# EAGLE design 224_distance (EAGLE 9.5.1)
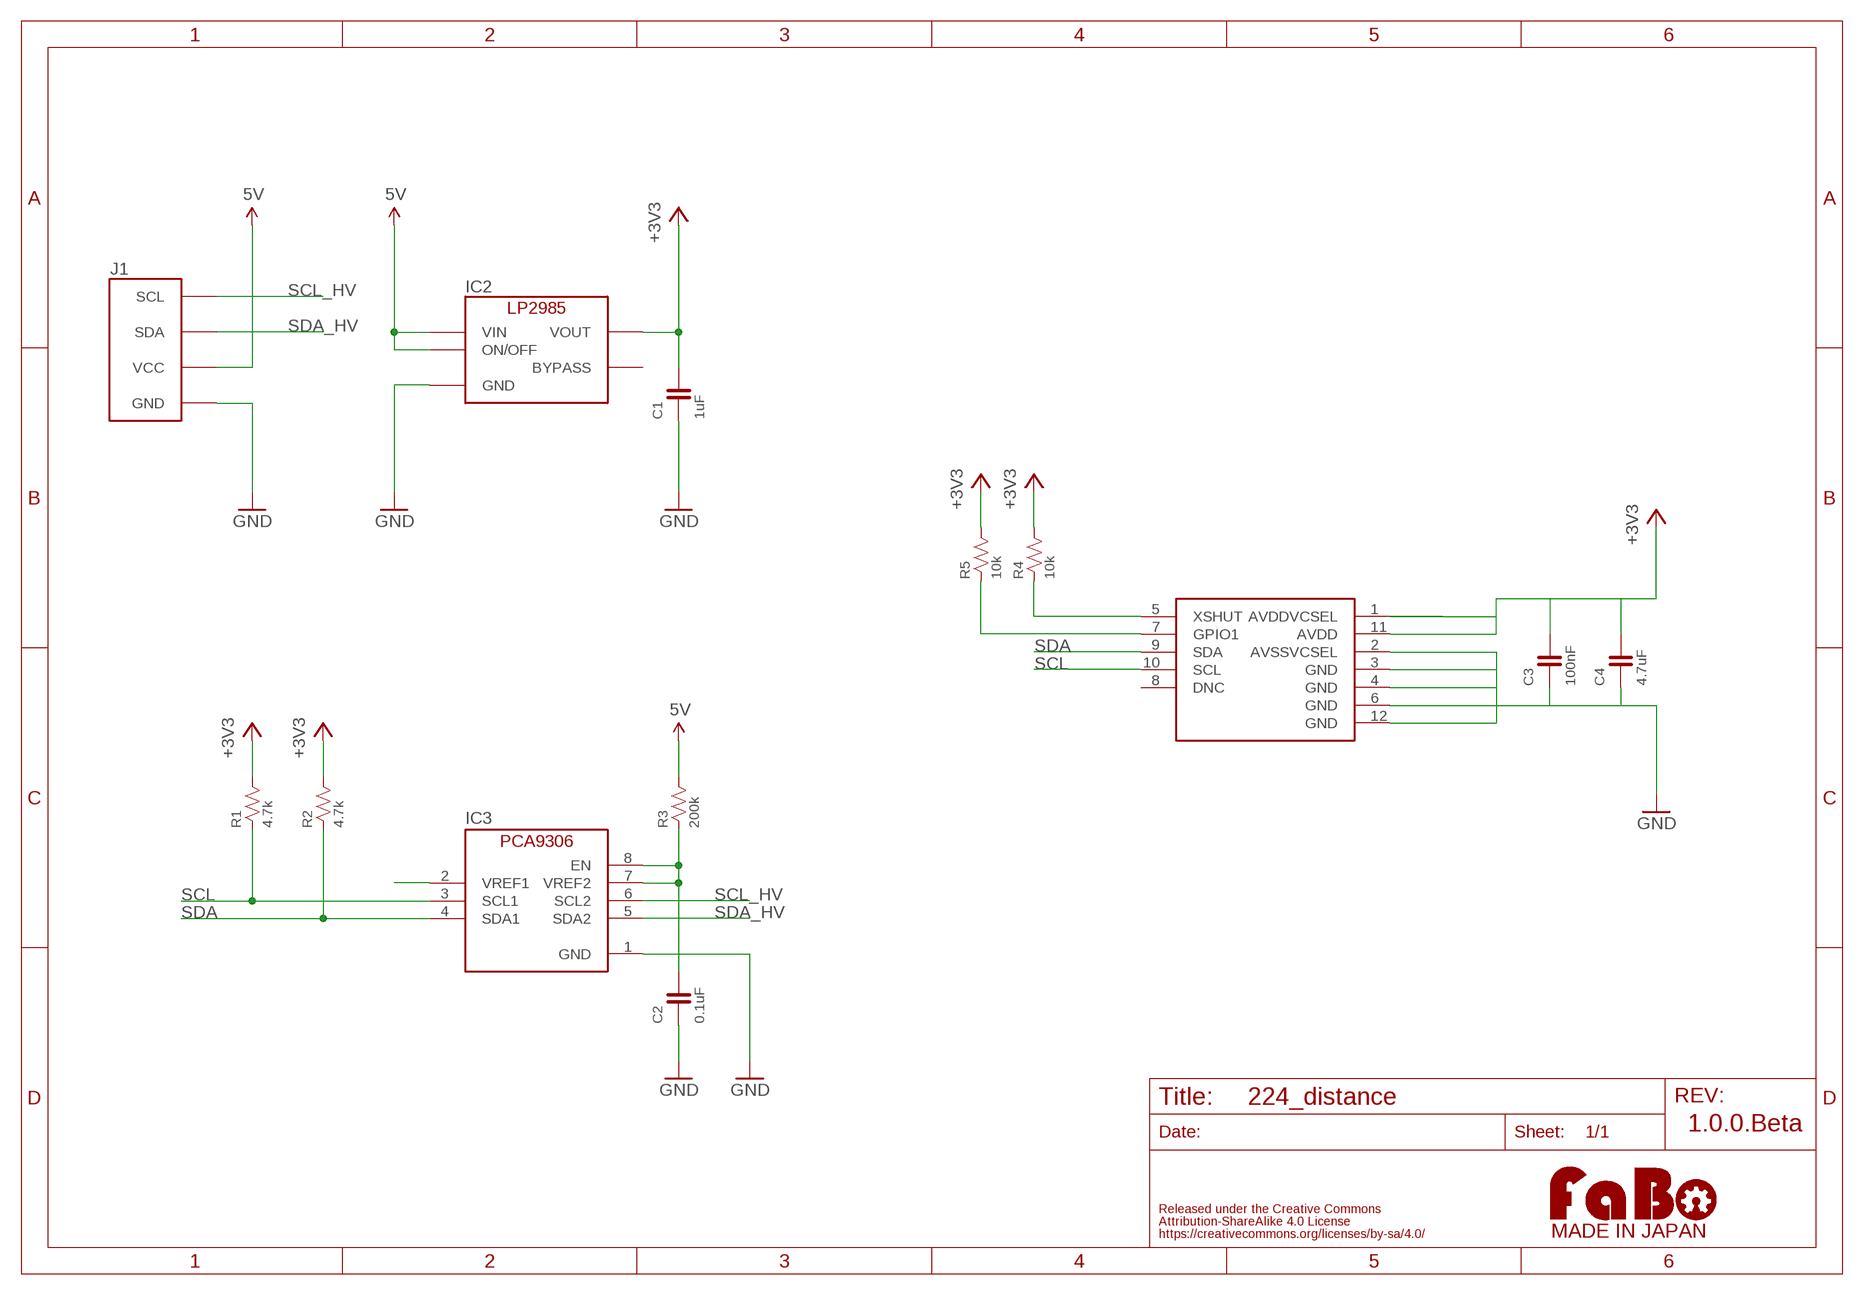
[diagram p0: schematic, sheet 1]

## Parts
C1  1uF  CAPACITOR-0603  [0603]
C2  0.1uF  CAPACITOR-0603  [0603]
C3  100nF  CAPACITOR-0603  [0603]
C4  4.7uF  CAPACITOR-0603  [0603]
IC2  LP2985-33DBV  [SOT-23-5]
IC3  PCA9306GM  [XQFN8]
J1  FABO_BRICK_I2C-S04B-PASK-2  [FABO_BRICK_I2C_S04B-PASK-2]
R1  4.7k  RESISTOR-0603  [0603]
R2  4.7k  RESISTOR-0603  [0603]
R3  200k  RESISTOR-0603  [0603]
R4  10k  RESISTOR-0603  [0603]
R5  10k  RESISTOR-0603  [0603]
U$3  LOGO_FABO-M  [LOGO_FABO_MS]
VL1  ST-VL53L0XVL53  [ST-VL53L0X]

## Nets
5V: IC2.1(VIN) IC2.3(ON/OFF) J1.VCC R3.2
+3V3: C1.2 C3.2 C4.2 IC2.5(VOUT) R1.2 R2.2 R4.2 R5.2 VL1.1(AVDDVCSEL) VL1.11(AVDD)
GND: C1.1 C2.1 C3.1 C4.1 IC2.2(GND) IC3.1(GND) J1.GND VL1.2(AVSSVCSEL) VL1.3(GND) VL1.4(GND) VL1.6(GND) VL1.12(GND)
N$1: C2.2 IC3.7(VREF2) IC3.8(EN) R3.1
N$3: IC3.2(VREF1)
N$5: R4.1 VL1.5(XSHUT)
N$6: R5.1 VL1.7(GPIO1)
SCL: IC3.3(SCL1) R1.1 VL1.10(SCL)
SCL_HV: IC3.6(SCL2) J1.SCL
SDA: IC3.4(SDA1) R2.1 VL1.9(SDA)
SDA_HV: IC3.5(SDA2) J1.SDA
Unconnected: IC2.4(BYPASS) VL1.8(DNC)

## Notes on the sheet
- 1.0.0.Beta

## Library data of the parts
C1-C4 = FaBo-Capacitor:CAPACITOR: CAPACITOR
IC2 = FaBo-Supply:LP2985: LP2985
IC3 = FaBo-LevelTranslator:PCA9306
J1 = FaBo-Template:FABO_BRICK_I2C: FaBo Brick I2C
R1-R5 = FaBo-Resistors:RESISTOR: RESISTOR
U$3 = FaBo-etc:LOGO_FABO
VL1 = FaBo-Mems:ST-VL53L0X

## Board
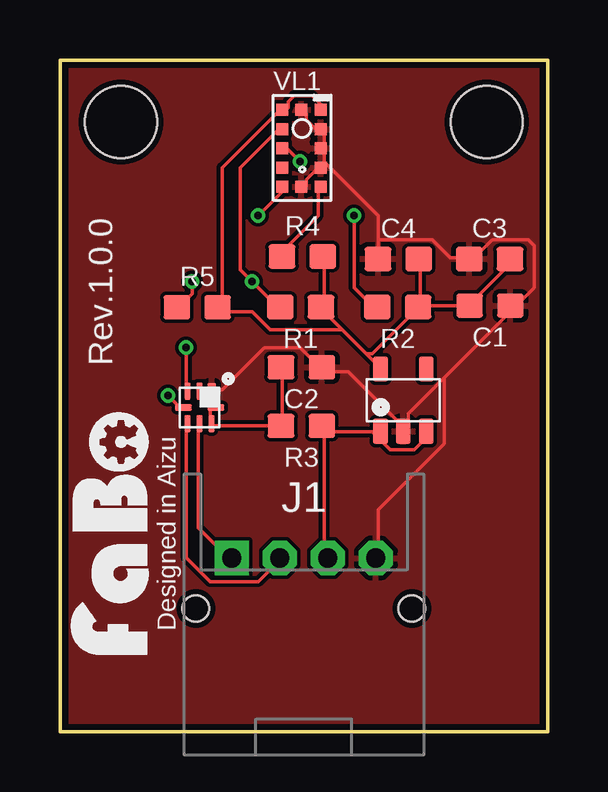
[diagram p1: board, top side]
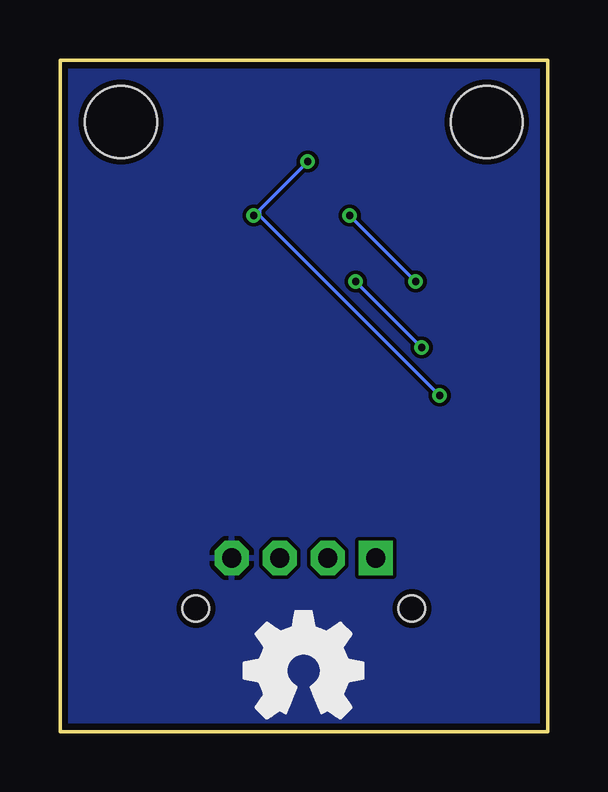
[diagram p2: board, bottom side, seen from below]

Size 20.32 x 27.98 mm. Coordinates in mm from the lower left corner, seen from the top.
Outline: 0,0 20.32,0 20.32,27.98 0,27.98 0,0
Copper layers (1*16): Top 0.035mm / dielectric 1.6mm / Bottom 0.035mm
Design rules "PCBway": minimum track width 6mil, minimum drill 12mil, track to track 6mil, track to pad 6mil, pad to pad 6mil, via to via 6mil, smd to smd 6mil, copper to edge 10mil, drill to drill 10mil, minimum pad ring 10mil, minimum via ring 6mil, stop-mask expansion 2mil, vias tented up to drill 100mil, thermal gap 8mil
Holes 3 mm at 2.54,25.4 17.78,25.4

### Footprints (pad centres in the part's own frame; a part is rotated, then mirrored left to right if it is on the bottom)
0603 = smd 1.1 x 1: 1 -0.85,0; 2 0.85,0
SOT-23-5 = smd 0.6 x 1.05: 1 -0.95,-1.3; 2 0,-1.3; 3 0.95,-1.3; 4 0.95,1.3; 5 -0.95,1.3
XQFN8 = smd 0.7 x 0.35: 1 -0.675,0.5 | smd 0.7 x 0.25: 2 -0.675,0; 3 -0.675,-0.5; 5 0.675,-0.5; 6 0.675,0; 7 0.675,0.5 | smd 0.25 x 0.7: 4 0,-0.675; 8 0,0.675
FABO_BRICK_I2C_S04B-PASK-2 = drill 0.8 pad 1.422 octagon: GND -3,0; SDA 1,0; VCC -1,0 | drill 0.8 pad 1.422 square: SCL 3,0 | hole 1.1: 4.5,2.1; -4.5,2.1
ST-VL53L0X = smd 0.5 x 0.5: 1 0.77,1.58; 2 0.77,0.78; 3 0.77,-0.02; 4 0.77,-0.82; 5 0.77,-1.62; 6 -0.03,-1.62; 7 -0.83,-1.62; 8 -0.83,-0.82; 9 -0.83,-0.02; 10 -0.83,0.78; 11 -0.83,1.58; 12 -0.03,1.58

### Placement (x,y rotation side)
C1  17.91,17.75 180 top
C2  10.06,15.18 180 top
C3  17.9,19.69 0 top
C4  14.1,19.69 0 top
IC2  14.3,13.8 0 top
IC3  5.82,13.51 270 top
J1  10.16,7.23 180 top
R1  10.03,17.68 0 top
R2  14.07,17.68 0 top
R3  10.06,12.73 0 top
R4  10.1,19.79 0 top
R5  5.72,17.68 0 top
U$2  [LOGO_OSHW_M_BOTTOM]  10.16,2.54 0 top
U$3  4.06,8.26 90 top
VL1  10.09,24.32 0 top

### Tracks (layer width: path | path; a pad name or v marks a point on that pad's centre or on a via)
5V
  Top 0.152: 11,12.5 13,12.5 | 13,12.5 13.25,12.5 IC2.1 | 13,12.5 13.75,11.75 14.75,11.75 15.25,12.25 IC2.3 | 11,12.5 11,7.25 J1.VCC | 11,12.5 R3.2
+3V3
  Top 0.152: 15,17.75 15,19.5 C4.2 | 15,17.75 17,17.75 | 15,17.75 R2.2 14.75,17.5 13,15.75 12.75,15.75 | 17,17.75 18.75,19.5 C3.2 | 17,17.75 C1.2 | VL1.1 11,26 10.5,26.5 9.75,26.5 9.5,26.25 9.5,26 VL1.11 9.25,25.75 9,25.75 6.75,23.5 6.75,17.75 R5.2 6.75,17.5 8,17.5 8.75,16.75 11.75,16.75 | 11.75,16.75 11,17.5 R1.2 11,17.75 11,19.75 R4.2 | 11.75,16.75 12.75,15.75 | 12.75,15.75 13.25,15.25 IC2.5
GND
  Top 0.152: VL1.6 10.25,22.75 10.25,23 10.75,23.5 VL1.4 11,23.5 11,23.75 | VL1.12 10.25,25.75 10.25,25.5 10.75,25 VL1.2 11,25 11,24.5 VL1.3 11,24.25 11,23.75 | 13.25,20.5 13.25,21.5 11,23.75 | 13.25,20.5 C4.1 | 13.25,20.5 15.5,20.5 16.25,19.75 17,19.75 C3.1 17.25,19.75 18,20.5 19.5,20.5 19.75,20.25 19.75,18.5 19,17.75 C1.1 18.75,17.5 16,14.75 | IC3.1 6.25,14.25 6.75,14.25 8.5,16 10,16 10.75,15.25 C2.1 11,15 12,15 14.25,12.75 IC2.2 14.5,12.75 14.5,13.25 16,14.75 | 16,14.75 16,12 13.25,9.25 13.25,7.25 J1.GND
  pour Top: 0,0 20.32,0 20.32,27.94 0,27.94
  pour Bottom: 0,0 20.32,0 20.32,27.94 0,27.94
N$1
  Top 0.152: IC3.8 6.25,13.5 6.25,13 IC3.7 6.25,12.75 9,12.75 R3.1 9.25,12.75 9.25,15 C2.2
N$5
  Top 0.152: VL1.5 10.75,22.5 10.75,21.5 9.25,20 R4.1
N$6  (via drill 0.3)
  Top 0.152: v8.25,21.5 9.25,22.5 VL1.7 | v5.5,18.75 5.5,18.25 5,17.75 R5.1
  Bottom 0.152: v5.5,18.75 v8.25,21.5
SCL  (via drill 0.3)
  Top 0.152: VL1.10 9.25,25 9,25 7.5,23.5 7.5,19.25 v8,18.75 9,17.75 R1.1 | v5.25,16 5.25,14.25 IC3.3
  Bottom 0.152: v8,18.75 v5.25,16
SCL_HV
  Top 0.152: IC3.6 5.75,12.75 5.75,8.5 7,7.25 J1.SCL
SDA  (via drill 0.3)
  Top 0.152: v10,23.75 9.5,24.25 VL1.9 | v12.25,21.5 12.25,18.5 13,17.75 R2.1 | v4.5,14 5,13.5 IC3.4
  Bottom 0.152: v12.25,21.5 12,21.75 | 12,21.75 v10,23.75 | v4.5,14 12,21.5 12,21.75
SDA_HV
  Top 0.152: IC3.5 5.25,12.75 5.25,7.25 6.25,6.25 8.25,6.25 9,7 J1.SDA

### Text on the board
tPlace: Rev.1.0.0 | Designed in Aizu